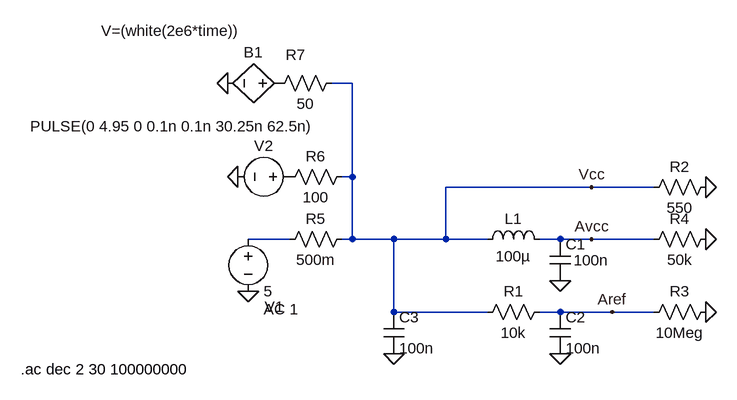
[diagram p0: schematic MCU Power In.asc]
MCU Power In.asc, the LTspice schematic file:
Version 4
SHEET 1 880 680
WIRE -48 -112 -80 -112
WIRE -48 32 -48 -112
WIRE -48 32 -64 32
WIRE 320 48 96 48
WIRE 416 48 320 48
WIRE -144 128 -208 128
WIRE -48 128 -48 32
WIRE -48 128 -64 128
WIRE 16 128 -48 128
WIRE 96 128 96 48
WIRE 96 128 16 128
WIRE 160 128 96 128
WIRE 272 128 240 128
WIRE 320 128 272 128
WIRE 416 128 320 128
WIRE 16 240 16 128
WIRE 160 240 16 240
WIRE 272 240 240 240
WIRE 352 240 272 240
WIRE 416 240 352 240
FLAG -208 208 0
FLAG 320 128 Avcc
FLAG 320 48 Vcc
FLAG 352 240 Aref
FLAG 272 304 0
FLAG 272 192 0
FLAG 16 304 0
FLAG 496 48 0
FLAG 496 240 0
FLAG 496 128 0
FLAG -224 32 0
FLAG -240 -112 0
SYMBOL voltage -208 112 R0
WINDOW 0 25 120 Left 2
WINDOW 123 24 124 Left 2
WINDOW 39 0 0 Left 0
SYMATTR InstName V1
SYMATTR Value 5
SYMATTR Value2 AC 1
SYMBOL ind 144 144 R270
WINDOW 0 32 56 VTop 2
WINDOW 3 5 56 VBottom 2
SYMATTR InstName L1
SYMATTR Value 100µ
SYMBOL cap 256 128 R0
WINDOW 3 37 32 Left 2
SYMATTR InstName C1
SYMATTR Value 100n
SYMBOL res 256 224 R90
WINDOW 0 0 56 VBottom 2
WINDOW 3 32 56 VTop 2
SYMATTR InstName R1
SYMATTR Value 10k
SYMBOL cap 256 240 R0
SYMATTR InstName C2
SYMATTR Value 100n
SYMBOL cap 0 240 R0
SYMATTR InstName C3
SYMATTR Value 100n
SYMBOL res 400 64 R270
WINDOW 0 32 56 VTop 2
WINDOW 3 0 56 VBottom 2
SYMATTR InstName R2
SYMATTR Value 550
SYMBOL res 400 256 R270
WINDOW 0 32 56 VTop 2
WINDOW 3 0 56 VBottom 2
SYMATTR InstName R3
SYMATTR Value 10Meg
SYMBOL res 400 144 R270
WINDOW 0 32 56 VTop 2
WINDOW 3 0 56 VBottom 2
SYMATTR InstName R4
SYMATTR Value 50k
SYMBOL voltage -128 32 R90
WINDOW 0 -32 56 VBottom 2
WINDOW 3 -93 196 VTop 2
WINDOW 123 0 0 Left 0
WINDOW 39 0 0 Left 0
SYMATTR InstName V2
SYMATTR Value PULSE(0 4.95 0 0.1n 0.1n 30.25n 62.5n)
SYMBOL res -48 112 R90
WINDOW 0 0 56 VBottom 2
WINDOW 3 32 56 VTop 2
SYMATTR InstName R5
SYMATTR Value 500m
SYMBOL res -48 16 R90
WINDOW 0 0 56 VBottom 2
WINDOW 3 32 56 VTop 2
SYMATTR InstName R6
SYMATTR Value 100
SYMBOL res -64 -128 R90
WINDOW 0 -12 71 VBottom 2
WINDOW 3 32 56 VTop 2
SYMATTR InstName R7
SYMATTR Value 50
SYMBOL bv -144 -112 R90
WINDOW 0 -32 56 VBottom 2
WINDOW 3 -96 183 VTop 2
SYMATTR InstName B1
SYMATTR Value V=(white(2e6*time))
TEXT -558 328 Left 2 !.ac dec 2 30 100000000

The netlist it stands for:
* MCU Power In.asc
V1 N001 0 5 AC 1
L1 Vcc Avcc 100µ
C1 Avcc 0 100n
R1 Aref Vcc 10k
C2 Aref 0 100n
C3 Vcc 0 100n
R2 Vcc 0 550
R3 Aref 0 10Meg
R4 Avcc 0 50k
V2 P001 0 PULSE(0 4.95 0 0.1n 0.1n 30.25n 62.5n)
R5 Vcc N001 500m
R6 Vcc P001 100
R7 Vcc P002 50
B1 P002 0 V=(white(2e6*time))
.ac dec 2 30 100000000
.backanno
.end